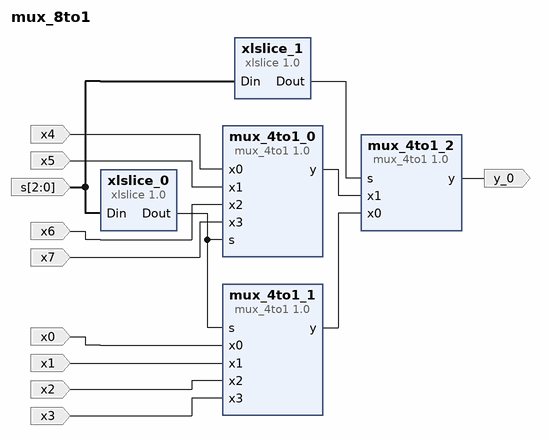
[diagram p0: block diagram of the top level]
# Vivado block design mux_8to1, xc7a100tcsg324-1, Vivado 2020.2
create_bd_design mux_8to1

create_bd_port -dir I x0
create_bd_port -dir I x1
create_bd_port -dir I x2
create_bd_port -dir I x3
create_bd_port -dir I x4
create_bd_port -dir I x5
create_bd_port -dir I x6
create_bd_port -dir I x7
create_bd_port -dir I -from 2 -to 0 s
create_bd_port -dir O y_0

create_bd_cell -type ip -vlnv xilinx.com:user:mux_4to1:1.0 mux_4to1_0
create_bd_cell -type ip -vlnv xilinx.com:user:mux_4to1:1.0 mux_4to1_1
create_bd_cell -type ip -vlnv xilinx.com:user:mux_4to1:1.0 mux_4to1_2
create_bd_cell -type ip -vlnv xilinx.com:ip:xlslice:1.0 xlslice_0
set_property -dict {CONFIG.DIN_FROM 1 CONFIG.DIN_TO 0 CONFIG.DIN_WIDTH 3 CONFIG.DOUT_WIDTH 2} [get_bd_cells xlslice_0]
create_bd_cell -type ip -vlnv xilinx.com:ip:xlslice:1.0 xlslice_1
set_property -dict {CONFIG.DIN_FROM 0 CONFIG.DIN_TO 0 CONFIG.DIN_WIDTH 3 CONFIG.DOUT_WIDTH 1} [get_bd_cells xlslice_1]

# ---- connections ----

connect_bd_net -net x0_0_1 [get_bd_ports x0] [get_bd_pins mux_4to1_1/x0]
connect_bd_net -net x1_0_1 [get_bd_ports x1] [get_bd_pins mux_4to1_1/x1]
connect_bd_net -net x2_0_1 [get_bd_ports x2] [get_bd_pins mux_4to1_1/x2]
connect_bd_net -net x3_0_1 [get_bd_ports x3] [get_bd_pins mux_4to1_1/x3]
connect_bd_net -net x0_0_2 [get_bd_ports x4] [get_bd_pins mux_4to1_0/x0]
connect_bd_net -net x1_0_2 [get_bd_ports x5] [get_bd_pins mux_4to1_0/x1]
connect_bd_net -net x2_0_2 [get_bd_ports x6] [get_bd_pins mux_4to1_0/x2]
connect_bd_net -net x3_0_2 [get_bd_ports x7] [get_bd_pins mux_4to1_0/x3]
connect_bd_net -net Din_0_1 [get_bd_ports s] [get_bd_pins xlslice_0/Din] [get_bd_pins xlslice_1/Din]
connect_bd_net [get_bd_pins xlslice_0/Dout] [get_bd_pins mux_4to1_1/s] [get_bd_pins mux_4to1_0/s]
connect_bd_net [get_bd_pins mux_4to1_1/y] [get_bd_pins mux_4to1_2/x0]
connect_bd_net [get_bd_pins mux_4to1_0/y] [get_bd_pins mux_4to1_2/x1]
connect_bd_net [get_bd_pins xlslice_1/Dout] [get_bd_pins mux_4to1_2/s]
connect_bd_net [get_bd_pins mux_4to1_2/y] [get_bd_ports y_0]

validate_bd_design
save_bd_design
